# Altium schematic sheet Power Distribution.SchDoc
size A3; SheetNumber: 2; SheetTotal: 2
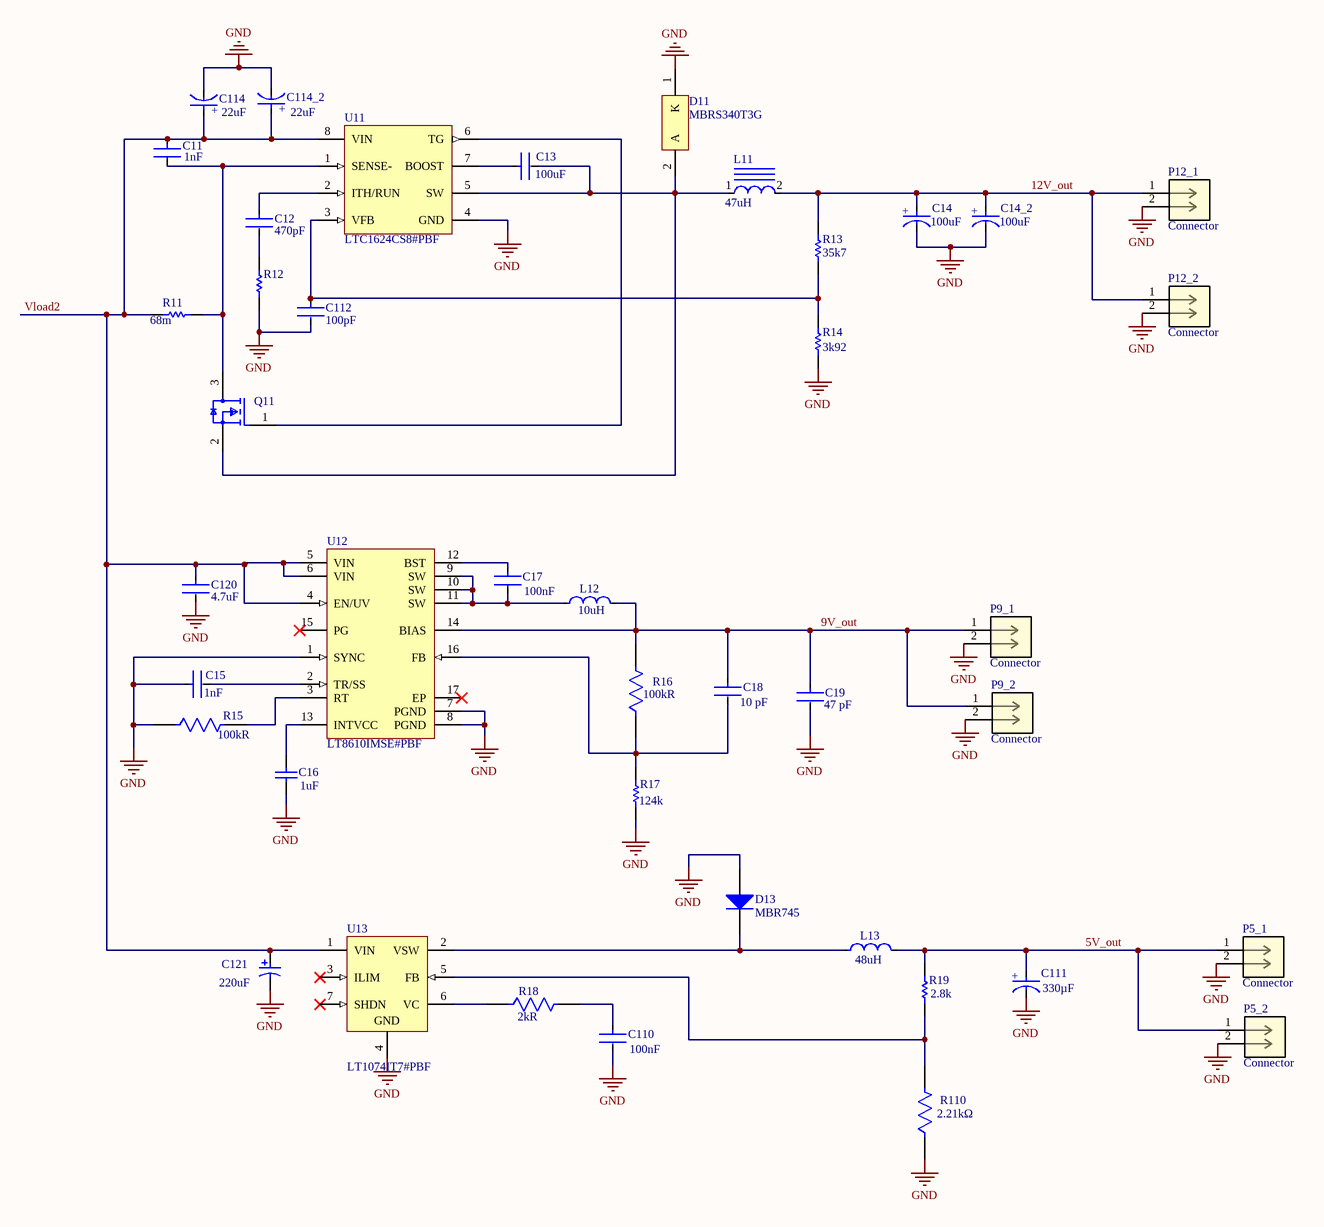
[diagram p0: Power Distribution.SchDoc]

## Parts
C11  Capacitance: 1nF  [FP-0805-L_2_01_0_2-W_1_25-IPC_B]  (hidden comment: 08055C102KAT2A)
C12  Capacitance: 470pF  [FP-0805-L_2_01_0_2-W_1_25-IPC_B]  (hidden comment: 08055C471KAT2A)
C13  Capacitance: 100uF  [FP-GRM21B-0_2-e0_2_0_7-IPC_B]  (hidden comment: GRM21BR60J107ME15L)
C14  Capacitance: 100uF  [FP-RAD-TH-D_8_0_5-L_11_5-MFG]  (hidden comment: EEUFR1H101)
C14_2  Capacitance: 100uF  [FP-RAD-TH-D_8_0_5-L_11_5-MFG]  (hidden comment: EEUFR1H101)
C15  Capacitance: 1nF  [FP-0805-L_2_01_0_2-W_1_25-IPC_B]  (hidden comment: 08055C102KAT2A)
C16  value 1uF  [CAPC2013X140X50NL20T25]  (hidden comment: C0805C105K5RACTU)
C17  Capacitance: 100nF  [FP-0805-L_2_01_0_2-W_1_25-IPC_B]  (hidden comment: 08051C104KAT2A)
C18  value 10 pF  [FP-C0805C-DN-IPC_B]  (hidden comment: C0805C100J5GACTU)
C19  value 47 pF  [FP-C0805C-DN-MFG]  (hidden comment: C0805C470J1GACTU)
C110  Capacitance: 100nF  [FP-0805-L_2_01_0_2-W_1_25-IPC_B]  (hidden comment: 08051C104KAT2A)
C111  Capacitance: 330µF  [FP-FKD8-MFG]  (hidden comment: EEEFK0J331XP)
C112  Capacitance: 100pF  [FP-0805-L_2_01_0_2-W_1_25-IPC_B]  (hidden comment: 08051A101JAT2A)
C114  value 22uF  [FP-FKF-MFG]  (hidden comment: EEE-FK2A220P)
C114_2  value 22uF  [FP-FKF-MFG]  (hidden comment: EEE-FK2A220P)
C120  Capacitance: 4.7uF  [FP-C0805C475K8PACTU-MFG]  (hidden comment: C0805C475K8PACTU)
C121  value 220uF  [PNSC-EEE-FK1E221P_N]  (hidden comment: EEE-FK1E221P)
D11  MBRS340T3G  [ONSC-SMC-2-403-03_V]
D13  MBR745  [ONSC-TO-220-2-221B-04_E]
L11  Inductance: 47uH  [FP-DR127-MFG]  (hidden comment: DR127-470-R)
L12  Inductance: 10uH  [FP-CB3225-IPC_B]  (hidden comment: CBC3225T100MR)
L13  value 48uH  [FP-PCC-M0754M-MFG]  (hidden comment: ETQ-P5M470YFM)
P5_1  Connector  [CONN_B2B-XH-A_JST]
P5_2  Connector  [CONN_B2B-XH-A_JST]
P9_1  Connector  [CONN_B2B-XH-A_JST]
P9_2  Connector  [CONN_B2B-XH-A_JST]
P12_1  Connector  [CONN_B2B-XH-A_JST]
P12_2  Connector  [CONN_B2B-XH-A_JST]
Q11  DMN3404L-7  [FP-SOT23-MFG]  (value not drawn)
R11  value 68m  [RESC1608X55X30NL15T15]  (hidden comment: ERJ3BWFR068V)
R12  ERJ-6GEYJ682V  [RESC2013X70X40NL20T20]  (value not drawn)
R13  value 35k7  [RESC2013X70X40NL20T20]  (hidden comment: ERJ-6ENF3572V)
R14  value 3k92  [RESC2013X50X30NL20T20]  (hidden comment: CRCW08053K92FKEA)
R15  Resistance: 100kR  [FP-ERA6A-IPC_B]  (hidden comment: ERA-6AEB104V)
R16  Resistance: 100kR  [FP-RC0805-0_6-IPC_B]  (hidden comment: RC0805FR-07100KL)
R17  value 124k  [RESC2013X70X40NL20T20]  (hidden comment: ERJ-6ENF1243V)
R18  Resistance: 2kR  [FP-CRCW0805-e3-IPC_B]  (hidden comment: CRCW08052K00FKEA)
R19  value 2.8k  [RESC2013X70X40NL20T20]  (hidden comment: ERJ-6ENF2801V)
R110  Resistance: 2.21kΩ  [FP-ERJ6EN-MFG]  (hidden comment: ERJ-6ENF2211V)
U11  LTC1624CS8#PBF  [LT-S8-8_N]
U12  LT8610IMSE#PBF  [LT-MSE-16-EDP_N]
U13  LT1074IT7#PBF  [LT-T7-7-S_V]

## Nets
GND: C14.1(C) C14_2.1(C) C15.1 C16.1 C19.2 C110.2 C111.1(C) C112.2 C114.1(C) C114_2.1(C) C120.2 C121.2 D11.1(K) D13.3(A) P5_1.2 P5_2.2 P9_1.2 P9_2.2 P12_1.2 P12_2.2 R12.1 R14.1 R15.1 R17.1 R110.1 U11.4(GND) U12.1(SYNC) U12.7(PGND) U12.8(PGND) U13.4(GND)
5V_out: C111.2(A) L13.2 P5_1.1 P5_2.1 R19.2
9V_out: C18.1 C19.1 L12.2 P9_1.1 P9_2.1 R16.2 U12.14(BIAS)
12V_out: C14.2(A) C14_2.2(A) L11.2 P12_1.1 P12_2.1 R13.2
Vload2: C11.1 C114.2(A) C114_2.2(A) C120.1 C121.1 R11.1 U11.8(VIN) U12.4(EN/UV) U12.5(VIN) U12.6(VIN) U13.1(VIN)
NetC11_2: C11.2 Q11.3(D) R11.2 U11.1(SENSE-)
NetC12_1: C12.1 U11.2(ITH/RUN)
NetC12_2: C12.2 R12.2
NetC13_1: C13.1 U11.7(BOOST)
NetC13_2: C13.2 D11.2(A) L11.1 Q11.2(S) U11.5(SW)
NetC15_2: C15.2 U12.2(TR/SS)
NetC16_2: C16.2 U12.13(INTVCC)
NetC17_1: C17.1 U12.12(BST)
NetC17_2: C17.2 L12.1 U12.9(SW) U12.10(SW) U12.11(SW)
NetC18_2: C18.2 R16.1 R17.2 U12.16(FB)
NetC110_1: C110.1 R18.2
NetC112_1: C112.1 R13.1 R14.2 U11.3(VFB)
NetD13_1: D13.1(K) L13.1 U13.2(VSW)
NetQ11_1: Q11.1(G) U11.6(TG)
NetR15_2: R15.2 U12.3(RT)
NetR18_1: R18.1 U13.6(VC)
NetR19_1: R19.1 R110.2 U13.5(FB)

Not connected (* = marked no-connect by the designer): U12 15(PG)* 17(EP)*; U13 3(ILIM)* 7(SHDN)*

## Notes on the sheet
- (in symbol CMP-00287-19020489-1) +
- (in symbol CMP-05427-000080-1) +
- (in symbol CMP-05427-002079-1) +

## Library data of the parts
C11 C15 = CMP-1036-02979-3: General Purpose Ceramic Capacitor, 0805, 1nF, 10%, X7R, 0.15, 50V; Dissipation Factor: 2.5%; Insulation Resistance: 100GR; Radiation Hardening: No; Case Code (Imperial): 0805; Packaging: Tape and Reel; Height: 0.94mm; Number of Pins: 2; REACH SVHC: No SVHC; Case Code (Metric): 2012; Voltage: 50V; Max Operating Temperature: 125°C; Tolerance: 10%; Voltage Rating: 50V; Depth: 1.25mm; Voltage Rating (DC): 50V; Thickness: 0.037inch; Termination: SMD/SMT; Package Quantity: 1; RoHS Compliant: Yes; Mount: Surface Mount; Dielectric: X7R; Length: 2.01mm; Contact Plating: Tin; Lead Free: Lead Free; Case/Package: 0805; Width: 1.25mm; Dielectric Material: Ceramic; Min Operating Temperature: -55°C
C12 = CMP-2007-04698-2: General Purpose Ceramic Capacitor, 0805, 470pF, 10%, X7R, 0.15, 50V; Dissipation Factor: 2.5%; Mount: Surface Mount; Case/Package: 0805; Lead Free: Lead Free; Case Code (Imperial): 0805; Number of Pins: 2; Thickness: 0.037inch; Min Operating Temperature: -55°C; Package Quantity: 1; Radiation Hardening: No; Dielectric: X7R; REACH SVHC: No SVHC; Case Code (Metric): 2012; Termination: SMD/SMT; Depth: 1.25mm; Packaging: Tape and Reel; Voltage Rating: 50V; Series: -; Width: 1.25mm; Construction: Flat; Voltage: 50V; Tolerance: 10%; RoHS Compliant: Yes; Height: 0.94mm; Length: 2.01mm; Contact Plating: Tin; Max Operating Temperature: 125°C; Voltage Rating (DC): 50V
C13 = CMP-2000-07599-2: Chip Multilayer Ceramic Capacitors for General Purpose, 0805, 100uF, X5R, 15%, 20%, 6.3V; Length: 0.079inch; Dielectric: X5R; Case Code (Metric): 2012; Max Operating Temperature: 85°C; Voltage Rating (DC): 6.3V; Min Operating Temperature: -55°C; Tolerance: 20%; Packaging: Cut Tape; Voltage Rating: 6.3V; REACH SVHC: No SVHC; Width: 0.049inch; Mount: Surface Mount; Case/Package: 0805; Case Code (Imperial): 0805; Lead Free: Lead Free; Thickness: 0.057inch
C14 C14_2 = CMP-05427-002079-1: Aluminum Electrolytic Capacitors (Radial Lead Type) 100uF ±20% 50V; ESR (Equivalent Series Resistance): 61mR; Lead Diameter: 0.6mm; Ripple Current (AC): 870mA; Life (Hours): 6000Hour; Lead/Base Style: Straight; Height - Seated (Max): 0.512inch; Height: 11.5mm; REACH SVHC: No SVHC; Contact Plating: Tin; Impedance: 61mR; Voltage: 50V; Termination: Radial; Series: FR; Voltage Rating: 50V; Lead Pitch: 3.5mm; Diameter: 8mm; Number of Pins: 2; Min Operating Temperature: -40°C; Mount: Through Hole; Ripple Current: 870mA; Radiation Hardening: No; Length: 11.5mm; Max Operating Temperature: 105°C; Construction: RADIAL; Packaging: Bulk; Package Quantity: 200; Case/Package: Radial; RoHS Compliant: Yes; Voltage Rating (DC): 50V; Tolerance: 20%
C16 = CMP-2007-03236-1: Manufacturer: Kemet; Part Number: C0805C105K5RACTU
C17 C110 = CMP-2007-04174-2: General Purpose Ceramic Capacitor, 0805, 100nF, 10%, X7R, 15%, 100V; Packaging: Tape and Reel; Min Operating Temperature: -55°C; Dielectric Material: Ceramic; Height: 1.4mm; Voltage Rating: 100V; Termination: SMD/SMT; Case Code (Imperial): 0805; Case Code (Metric): 2012; Case/Package: 0805; Construction: Flat; Radiation Hardening: No; Series: -; Dielectric: X7R; Package Quantity: 2000; Mount: Surface Mount; Contact Plating: Tin; Voltage: 100V; Lead Free: Lead Free; Depth: 1.25mm; RoHS Compliant: Yes; Number of Pins: 2; Max Operating Temperature: 125°C; Length: 2.01mm; Voltage Rating (DC): 100V; Thickness: 0.055inch; REACH SVHC: No SVHC; Width: 0.049inch; Tolerance: 10%
C18 = CMP-2007-00219-2: Capacitor; Ceramic; Cap 10 pF; Tol 5%; Vol-Rtg 50 VDC; SMT; 0805; COG (NPO); Tape&Reel; Manufacturer: KEMET; Temperature Coefficient: 30ppm/°C; Voltage Rating: 50 V; Tolerance: 0.05; Temperature Characteristic: C0G; RoHS: TRUE; Mouser Description: KEMET - C0805C100J5GACTU - CAP, MLCC, C0G/NP0, 10PF, 50V, 0805; Temperature Range High: +125°C; Octopart: https://octopart.com/c0805c100j5gactu-kemet-104357; Automotive: No; Device Class L1: Passive Components; Temperature Range Low: -55°C; Device Class L3: Ceramic Capacitors; Material: Ceramic; Device Class L2: Capacitors; Lead Free: Yes; Manufacturer Part Number: C0805C100J5GACTU; Category: Cap; Ipc Land Pattern Name: CAPC200125X78; ComponentLink2Description: Datasheet; ComponentLink2URL: https://content.kemet.com/datasheets/KEM_C1003_C0G_SMD.pdf; Digikey Description: Capacitor; Ceramic; Cap 10 pF; Tol 5%; Vol-Rtg 50 VDC; SMT; 0805; COG (NPO); Tape&Reel; Temperature: -55°C to +125°C; Height: 0.88mm; Capacitance: 10 pF; Package: C0805C-DN
C19 = CMP-1036-01631-3: CAP CER 47PF 100V 5% NP0 0805; Manufacturer: KEMET; Temperature Characteristic: C0G; Material: Ceramic; Temperature Coefficient: 30ppm/°C; Tolerance: 0.05; Device Class L3: Ceramic Capacitors; Package: C0805C-DN; Category: Cap; ComponentLink2URL: https://content.kemet.com/datasheets/KEM_C1003_C0G_SMD.pdf; Ipc Land Pattern Name: CAPC200125X78; Temperature Range Low: -55°C; Temperature: -55°C to +125°C; Temperature Range High: +125°C; Device Class L2: Capacitors; Height: 0.88mm; Octopart: https://octopart.com/c0805c470j1gactu-kemet-9138638; Digikey Description: CAP CER 47PF 100V 5% NP0 0805; Lead Free: Yes; Voltage Rating: 100 V; Device Class L1: Passive Components; Capacitance: 47 pF; Mouser Description: Capacitor: ceramic; MLCC; 47pF; 100V; C0G; ±5%; SMD; 0805; Manufacturer Part Number: C0805C470J1GACTU; RoHS: TRUE; ComponentLink2Description: Datasheet; Automotive: No
C111 = CMP-00287-19020489-1: EEEFK0J331XP Aluminum Electrolytic Capacitor, 330 uF, 6.3 V, ± 20%, 2000 hours @ 105°C, Radial Can - SMD; Ripple Current (AC): 280mA; Material: Aluminium; Voltage: 6.3V; Polarity: Polar; Impedance: 340mΩ; Leakage Current: 3µA; Radiation Hardening: No; Lifecycle Status: Production; Tolerance: 20%; Diameter: 6.3mm; Packaging: Cut Tape; Case/Package: Radial; NexarPartId: 19020489; Lead Free: Lead Free; Voltage Rating: 6.3V; Width: 7.8mm; REACH SVHC: No SVHC; Schedule B: 8532220020, 8532220020; Number of Pins: 2; Height - Seated (Max): 8.001mm; Mount: PCB, Surface Mount; Min Operating Temperature: -55°C; Height: 7.7mm; Ripple Current: 280mA; Max Operating Temperature: 105°C; Voltage Rating (DC): 6.3V; RoHS: Compliant; Life (Hours): 2000hours; Termination: SMD/SMT; Contact Plating: Tin; Length: 7.7mm; ESR (Equivalent Series Resistance): 340mΩ
C112 = CMP-2007-04121-2: General Purpose Ceramic Capacitor, 0805, 100pF, 5%, C0G, 30ppm/°C, 100V; Insulation Resistance: 100GR; Contact Plating: Tin; REACH SVHC: No SVHC; Temperature Coefficient: 30ppm/°C; Length: 2.01mm; Lead Free: Lead Free; Number of Pins: 2; Packaging: Tape and Reel; Dielectric: C0G; Width: 0.049inch; Case Code (Imperial): 0805; Max Operating Temperature: 125°C; Height: 0.94mm; Tolerance: 5%; Case Code (Metric): 2012; Construction: Flat; Voltage Rating: 100V; Thickness: 0.037inch; Case/Package: 0805; Package Quantity: 1; Size: 0.94mm; Depth: 1.25mm; Voltage: 100V; Min Operating Temperature: -55°C; RoHS Compliant: Yes; Termination: SMD/SMT; Mount: Surface Mount; Series: -; Radiation Hardening: No; Voltage Rating (DC): 100V
C114 C114_2 = CMP-05427-000080-1: CAP ALUM 22UF 20% 100V SMD
C120 = CMP-2007-01007-2: CAP CER 4.7UF 10V X5R 0805; Dielectric Material: Ceramic; Dissipation Factor: 5%; Tolerance: 10%; Lead Pitch: 0.75mm; Mount: Surface Mount; Voltage Rating (DC): 10V; Length: 2mm; Case Code (Imperial): 0805; Height: 1.25mm; Package Quantity: 1; Thickness: 0.055inch; Depth: 1.25mm; Case Code (Metric): 2012; Termination: SMD/SMT; Construction: Flat; Dielectric: X5R; Series: C; Width: 1.2mm; Max Operating Temperature: 85°C; Packaging: Tape and Reel; Voltage Rating: 10V; REACH SVHC: No SVHC; Min Operating Temperature: -55°C; Number of Pins: 2; Case/Package: 0805; Radiation Hardening: No; Lead Free: Lead Free; Voltage: 10V; RoHS Compliant: Yes
C121 = CMP-1665-00017-3: Aluminum Electrolytic Capacitor, 220 uF, +/- 20%, 25 V, -55 to 105 degC, 2-Pin CAPAE, RoHS, Tape and Reel; Manufacturer: Panasonic; Voltage Rating: 25 V; ComponentLink2URL: http://industrial.panasonic.com/cdbs/www-data/pdf/RDE0000/ABA0000C1181.pdf; Height: 10.2 mm; Max Operating Temperature: 105 degC; PackageReference: EEE-FK1E221P; ComponentLink1Description: Manufacturer URL; ComponentLink1URL: http://www.panasonic.com/; Mount: Surface Mount; REACH SVHC: No SVHC; Min Operating Temperature: -55 degC; ComponentLink2Description: Datasheet; DatasheetVersion: 03/2016; Length: 10.2 mm; RoHSCompliant: true; Packaging: Tape and Reel; Package Quantity: 500; Lead Pitch: 3.1 mm; Pins: 2; PackageDescription: 2-Pin Electrolytic Aluminum Capacitor, Body 8.3 x 8.3 mm; Mounting Technology: Surface Mount
D11 = CMP-1055-00380-1: Schottky Power Rectifier, 2-Pin SMC, Pb-Free, Tape and Reel; Manufacturer: On Semiconductor; Configuration: Single; IFSM Max (A): 80; ComponentLink3Description: Package Specification; ComponentLink1Description: Manufacturer URL; DatasheetVersion: Rev. 11; PackageDescription: 2-Pin Small Molded Package, J-Bend Lead, Body 5.845 x 6.855 mm; PackageVersion: Rev. E, 08/2005; RoHS: TRUE; Packing: Tape and Reel; PackageReference: SMC-2-403-03; ComponentLink3URL: http://www.onsemi.com/pub_link/Collateral/403-03.PDF; ComponentLink2URL: http://www.onsemi.cn/pub_link/Collateral/MBRS340T3-D.PDF; PartNumber: MBRS340T3G; Mounting Technology: Surface Mount; ComponentLink1URL: http://www.onsemi.com/; ComponentLink2Description: Datasheet
D13 = CMP-1055-00594-1: SWITCHMODE(TM) Power Rectifier, 2-Pin TO-220, Tube; Manufacturer: On Semiconductor; IFSM Max (A): 150; Configuration: Single; Mounting Technology: Through Hole; PackageVersion: Rev. E; ComponentLink3URL: http://www.onsemi.com/pub_link/Collateral/BYW29-D.PDF; PackageDescription: 2-Pin Flange Mount, Vertical Straight Lead, Body 9.97 x 4.44 mm, Pitch 5.08 mm; Packing: Tube; ComponentLink3Description: Package Specification; ComponentLink2Description: Datasheet; ComponentLink1URL: http://www.onsemi.com/; ComponentLink2URL: http://www.onsemi.cn/pub_link/Collateral/MBR735-D.PDF; RoHS: FALSE; ComponentLink1Description: Manufacturer URL; PackageReference: TO-220-2-221B-04_E; DatasheetVersion: Rev. 8; PartNumber: MBR745
L11 = CMP-16092-000004-1: FIXED IND 47UH 2.95A 71.9 MOHM; Max DC Current: 5.28A; Self Resonant Frequency: 100kHz; Inductance Tolerance: 20%; DC Resistance (DCR): 71.9mR; Shielding: Shielded; Core Material: Ferrite; Weight: 0.208oz; Composition: Wirewound; Saturation Current: 5.28A; REACH SVHC: No SVHC; Width: 0.492inch; Depth: 12.5mm; Package Quantity: 350; Height - Seated (Max): 0.315inch; Mount: Surface Mount; RMS Current (Irms): 2.95A; Min Operating Temperature: -40°C; Packaging: Tape and Reel; Number of Pins: 2; Height: 8mm; Max Operating Temperature: 125°C; Radiation Hardening: No; Termination: SMD/SMT; Case/Package: Nonstandard; Tolerance: 20%; Length: 12.5mm; Lead Free: Lead Free; Current Rating: 2.95A; Test Frequency: 100kHz; Military Standard: Not
L12 = CMP-14484-000123-1: SMD Inductors 10uH ±20% 0.9A 0.1729Ω 1210; Shielding: Unshielded; DC Resistance (DCR): 172.9mR; Core Material: Ferrite; Self Resonant Frequency: 23MHz; Max DC Current: 900mA; Test Frequency: 100kHz; Package Quantity: 1000; Military Standard: Not; Height: 2.5mm; Case Code (Metric): 3225; Width: 0.098inch; Case Code (Imperial): 1210; Inductance Tolerance: 20%; Lead Free: Lead Free; Length: 3.4mm; Max Operating Temperature: 105°C; Resistor Type: Wirewound; Height - Seated (Max): 0.106inch; Series: CB; Packaging: Tape and Reel; Depth: 2.7mm; Number of Pins: 2; Radiation Hardening: No; Tolerance: 20%; Case/Package: 1210; Mount: Surface Mount; Saturation Current: 900mA; Min Operating Temperature: -40°C; DC Current: 900mA; Current Rating: 900mA; Halogen Free: Halogen Free; Termination: SMD/SMT
L13 = CMP-05439-000008-1: FIXED IND 47UH 2.9A 172 MOHM SMD; Manufacturer: Panasonic; Saturation Current: 4.1A; Shielding: true; Series Resistance: 172mΩ; Standoff Height: 0.1mm; Core Material: Metal Composite; Automotive Grade: Grade 0; Test Frequency: 100kHz; Tolerance: 20%; Rms Current: 2.3A; Temperature Range Low: -40°C; Lead Free: Yes; Category: Ind; Temperature Range High: +150°C; ComponentLink2Description: Datasheet; Device Class L3: Fixed Inductors; Temperature: -40°C to +150°C; Manufacturer Part Number: ETQ-P5M470YFM; Device Class L2: Inductors; Device Class L1: Passive Components; Inductance: 48uH; Height: 5.4mm; Octopart: https://octopart.com/etqp5m470yfm-panasonic-7720762; Mouser Description: Fixed Inductors PCC 49uH 20% 1A AEC-Q200; Digikey Description: FIXED IND 47UH 2.9A 172 MOHM SMD; Package: PCC-M0754M; Automotive: Yes; RoHS: TRUE; ComponentLink2URL: https://industrial.panasonic.com/cdbs/www-data/pdf/AGL0000/AGL0000C59.pdf
P5_1 P5_2 P9_1 P9_2 P12_1 P12_2 = B2B-XH-A: Header B2B-XH-A, 2.50mm, 2-contacts, top entry, THT /1000/box; Manufacturer: JST; Supplier: Digikey; Supplier Part Number: 455-B2B-XH-A-ND; Manufacturer Part Number: B2B-XH-A; RoHS: Yes; Category: FFC / FPC; Stock: 990478; Pricing: 1=0.15, 10=0.122, 100=0.0898, 500=0.07432, 1000=0.06502, 5000=0.05573, 10000=0.05419 (USD); ComponentLink1URL: https://www.distrelec.biz/Web/Downloads/_t/ds/xh-series_eng_tds.pdf?mime=application%2Fpdf&src-supplier=Distrelec; ComponentLink1Description: https://www.distrelec.biz/Web/Downloads/_t/ds/xh-series_eng_tds.pdf?mime=application%2Fpdf&src-supplier=Distrelec
Q11 = CMP-12801-000054-1: MOSFET N-CH 30V 5.8A SOT-23; Manufacturer: Diodes Inc.; Gate Charge At Vgs: 11.3nC @ 10V; Number Of Channels: 1; Depletion Mode: False; Threshold Vgs Min: 1V; Max Junction Temp: +150°C; Automotive Grade: NA; Power Dissipation: 0.72W; Turn On Delay Time: 3.41ns; Drain To Source Resistance: 24mΩ; Continuous Drain Current: 4.2A; Gate To Source Voltage: 20V; Input Capacitace At Vds: 498pF @ 15V; Rthja Max: 173°C/W; Typ Forward Diode Voltage: 0.75V; Standoff Height: 0.013mm; Turn Off Delay Time: 13.92ns; Threshold Vgs Max: 2V; Pulse Drain Current: 30A; Category: Trans; Manufacturer Part Number: DMN3404L-7; Device Class L2: Transistors; Device Class L1: Discrete Semiconductors; RoHS: TRUE; Height: 1.1mm; Footprint Url: https://www.diodes.com/assets/Package-Files/SOT23.pdf; Temperature Range Low: -55°C; ComponentLink2Description: Datasheet; Package: SOT23; Mouser Description: N-Channel 30 V 28 mOhm Surface Mount Enhancement Mode Mosfet - SOT-23-3; Drain To Source Voltage: 30V; Device Class L3: MOSFETs; Temperature Range High: +150°C; Temperature: -55°C to +150°C; Drain To Source Breakdown Voltage: 30V; Digikey Description: MOSFET N-CH 30V 5.8A SOT-23; Automotive: No; ComponentLink2URL: https://www.diodes.com/assets/Datasheets/ds31787.pdf; Octopart: https://octopart.com/dmn3404l-7-diodes+inc.-12409285; Number Of N Channels: 1; Max Forward Diode Voltage: 1V; Lead Free: Yes
R11 = CMP-2000-00177-1: Manufacturer: Panasonic; Part Number: ERJ3BWFR068V
R12 = CMP-2001-00441-1: Manufacturer: Panasonic; Part Number: ERJ-6GEYJ682V
R13 = CMP-2001-00148-1: Manufacturer: Panasonic; Part Number: ERJ-6ENF3572V
R14 = CMP-2001-03888-1: Manufacturer: Vishay Dale; Part Number: CRCW08053K92FKEA
R15 = CMP-2001-00583-2: RES 100K OHM 0.1% 1/8W 0805; Max Power Dissipation: 125mW; Voltage Rating: 100V; Temperature Coefficient: 25ppm/°C; Resistance Tolerance: 0.1%; Resistor Type: Thin Film; Mount: Surface Mount; Package Quantity: 1; RoHS Compliant: Yes; Features: Automotive AEC-Q200; Termination: Solder; Contact Plating: Tin; Number of Pins: 2; Construction: Rectangular; Size Code: 0805; Case/Package: 0805; Military Standard: Not; Voltage Rating (DC): 100V; Max Operating Temperature: 155°C; REACH SVHC: No SVHC; Series: ERA-6A; Case Code (Metric): 2012; Number of Terminations: 2; Tolerance: 0.1%; Width: 1.25mm; Depth: 1.25mm; Lead Free: Lead Free; Radiation Hardening: No; Length: 2mm; Technology: METAL FILM; Power Rating: 125mW; Min Operating Temperature: -55°C; Height: 0.5mm; Case Code (Imperial): 0805; Packaging: Tape and Reel
R16 = CMP-2100-03668-5: RES 100K OHM 1% 1/8W 0805; Power Rating: 125mW; Temperature Coefficient: 100ppm/°C; Voltage Rating (DC): 150V; Package Quantity: 1; Case/Package: 0805; Lead Pitch: 0.4mm; Case Code (Imperial): 0805; Construction: Rectangular; Number of Terminations: 2; RoHS Compliant: Yes; Max Power Dissipation: 125mW; Tolerance: 1%; Max Operating Temperature: 155°C; Resistance Tolerance: 1%; Lead Free: Lead Free; Packaging: Tape and Reel; Resistor Type: Thick Film; Min Operating Temperature: -55°C; Case Code (Metric): 2012; Series: RC; Technology: THICK FILM; Voltage Rating: 150V; Termination: SMD/SMT; Width: 0.049inch; Number of Pins: 2; Features: Moisture Resistant; Military Standard: Not; Length: 0.079inch; Depth: 1.25mm; Size Code: 0805; Height: 0.024inch
R17 = CMP-2001-04408-1: Manufacturer: Panasonic; Part Number: ERJ-6ENF1243V
R18 = CMP-2001-03755-2: RES Thick Film, 2kΩ, 1%, 0.125W, 100ppm/°C, 0805; Working Voltage: 150V; Max Power Dissipation: 125mW; Package Quantity: 10; Case Code (Metric): 2012; Voltage Rating: 150V; Number of Terminations: 2; Max Operating Temperature: 155°C; Depth: 1.25mm; Tolerance: 1%; Power Rating: 125mW; Lead Free: Lead Free; Case/Package: 0805; Features: Automotive AEC-Q200; Min Operating Temperature: -55°C; Termination: SMD/SMT; Case Code (Imperial): 0805; Weight: 0.000194oz; Packaging: Tape and Reel; Military Standard: Not; Radiation Hardening: No; Contact Plating: Tin; Mount: Surface Mount; Temperature Coefficient: 100ppm/°C; Height: 0.02inch; Number of Terminals: 2; Voltage Rating (DC): 150V; Number of Pins: 2; Length: 2mm; Width: 1.25mm; Composition: Thick Film
R19 = CMP-2001-00098-1: Manufacturer: Panasonic; Part Number: ERJ-6ENF2801V
R110 = CMP-1013-00547-3: NexarPartId: 55422515; Tolerance: 1%; Voltage Rating: 150V; Power Rating: 125mW; Temperature Coefficient: 100ppm/°C; Depth: 1.25mm; Width: 1.2446mm; Radiation Hardening: No; Lifecycle Status: Production; Length: 2mm; Lead Free: Lead Free; Contact Plating: Tin; Voltage Rating (DC): 150V; Case Code (Metric): 2012; Mount: Surface Mount; Case Code (Imperial): 0805; Termination: SMD/SMT; Min Operating Temperature: -55°C; Case/Package: 0805; Packaging: Cut Tape; RoHS: Compliant; Height: 700µm; Max Operating Temperature: 155°C; Number of Terminations: 2; Schedule B: 8533210045, 8533210045; REACH SVHC: Unknown; Military Standard: Not; Max Power Dissipation: 125mW; Composition: Thick Film
U11 = CMP-0492-01970-1: High Efficiency N-Channel Switching Regulator Controller, 8-pin SOIC (S8-8), 0 to 70 degC, Pb-Free; Manufacturer: Linear Technology; Number of Outputs: 1; PartNumber: LTC1624CS8#PBF; ComponentLink1Description: Manufacturer URL; Mounting Technology: Surface Mount; PackageDescription: 8-Pin Plastic Small Outline (Narrow .150 Inch), Body 4.9 x 3.9 mm, Pitch 1.27 mm; ComponentLink3Description: Package Specification; ComponentLink1URL: http://www.linear.com/; PackageVersion: Rev. G, 03/2012; ComponentLink2Description: Datasheet; ComponentLink2URL: http://cds.linear.com/docs/en/datasheet/1624f.pdf; PackageReference: S8-8; ComponentLink3URL: http://cds.linear.com/docs/en/packaging/05081610_G_SO8.pdf; RoHS: TRUE
U12 = CMP-0491-01208-1: 2.5 A Synchronous Step-Down Regulator 2.5 uA Quiescent Current, 16-pin SOP (MSE-16-EDP), -40 to 125 degC, Pb-Free; Manufacturer: Linear Technology; Number of Outputs: 1; Frequency Adjust Range: 200kHz - 2.2MHz; ComponentLink1URL: http://www.linear.com/; PartNumber: LT8610IMSE#PBF; PackageVersion: Rev. F, 05/2013; ComponentLink1Description: Manufacturer URL; PackageReference: MSE-16; RoHS: TRUE; PackageDescription: 16-Pin Plastic MSOP, Exposed Die Pad, Body 4.039 x 3 mm, Pitch 0.5 mm; Mounting Technology: Surface Mount; ComponentLink3Description: Package Specification; ComponentLink3URL: http://cds.linear.com/docs/en/packaging/05081667_F_MSE16.pdf; ComponentLink2URL: http://cds.linear.com/docs/en/datasheet/8610f.pdf; ComponentLink2Description: Datasheet
U13 = CMP-0491-02081-1: Step-Down Switching Regulator, 7-pin FM (T7-7), -40 to 85 degC, Pb-Free; Manufacturer: Linear Technology; Number of Outputs: 1; ComponentLink2URL: http://cds.linear.com/docs/en/datasheet/1074fds.pdf; ComponentLink1Description: Manufacturer URL; ComponentLink2Description: Datasheet; ComponentLink3Description: Package Specification; PackageReference: T7-7; DatasheetVersion: Rev. D; PartNumber: LT1074IT7#PBF; PackageDescription: 7-Pin Plastic TO-220 (Straight Lead), Body 10.224 x 4.382 mm, Pitch 1.27 mm; ComponentLink1URL: http://www.linear.com/; Mounting Technology: Through Hole; ComponentLink3URL: http://www.linear.com/docs/en/packaging/TO-220_7_05-08-1422_STRAIGHT_LEAD.pdf; RoHS: TRUE; PackageVersion: Jun-10